# EAGLE design XBee-Explorer-Dongle-Sparkfun (EAGLE 6.6.0)
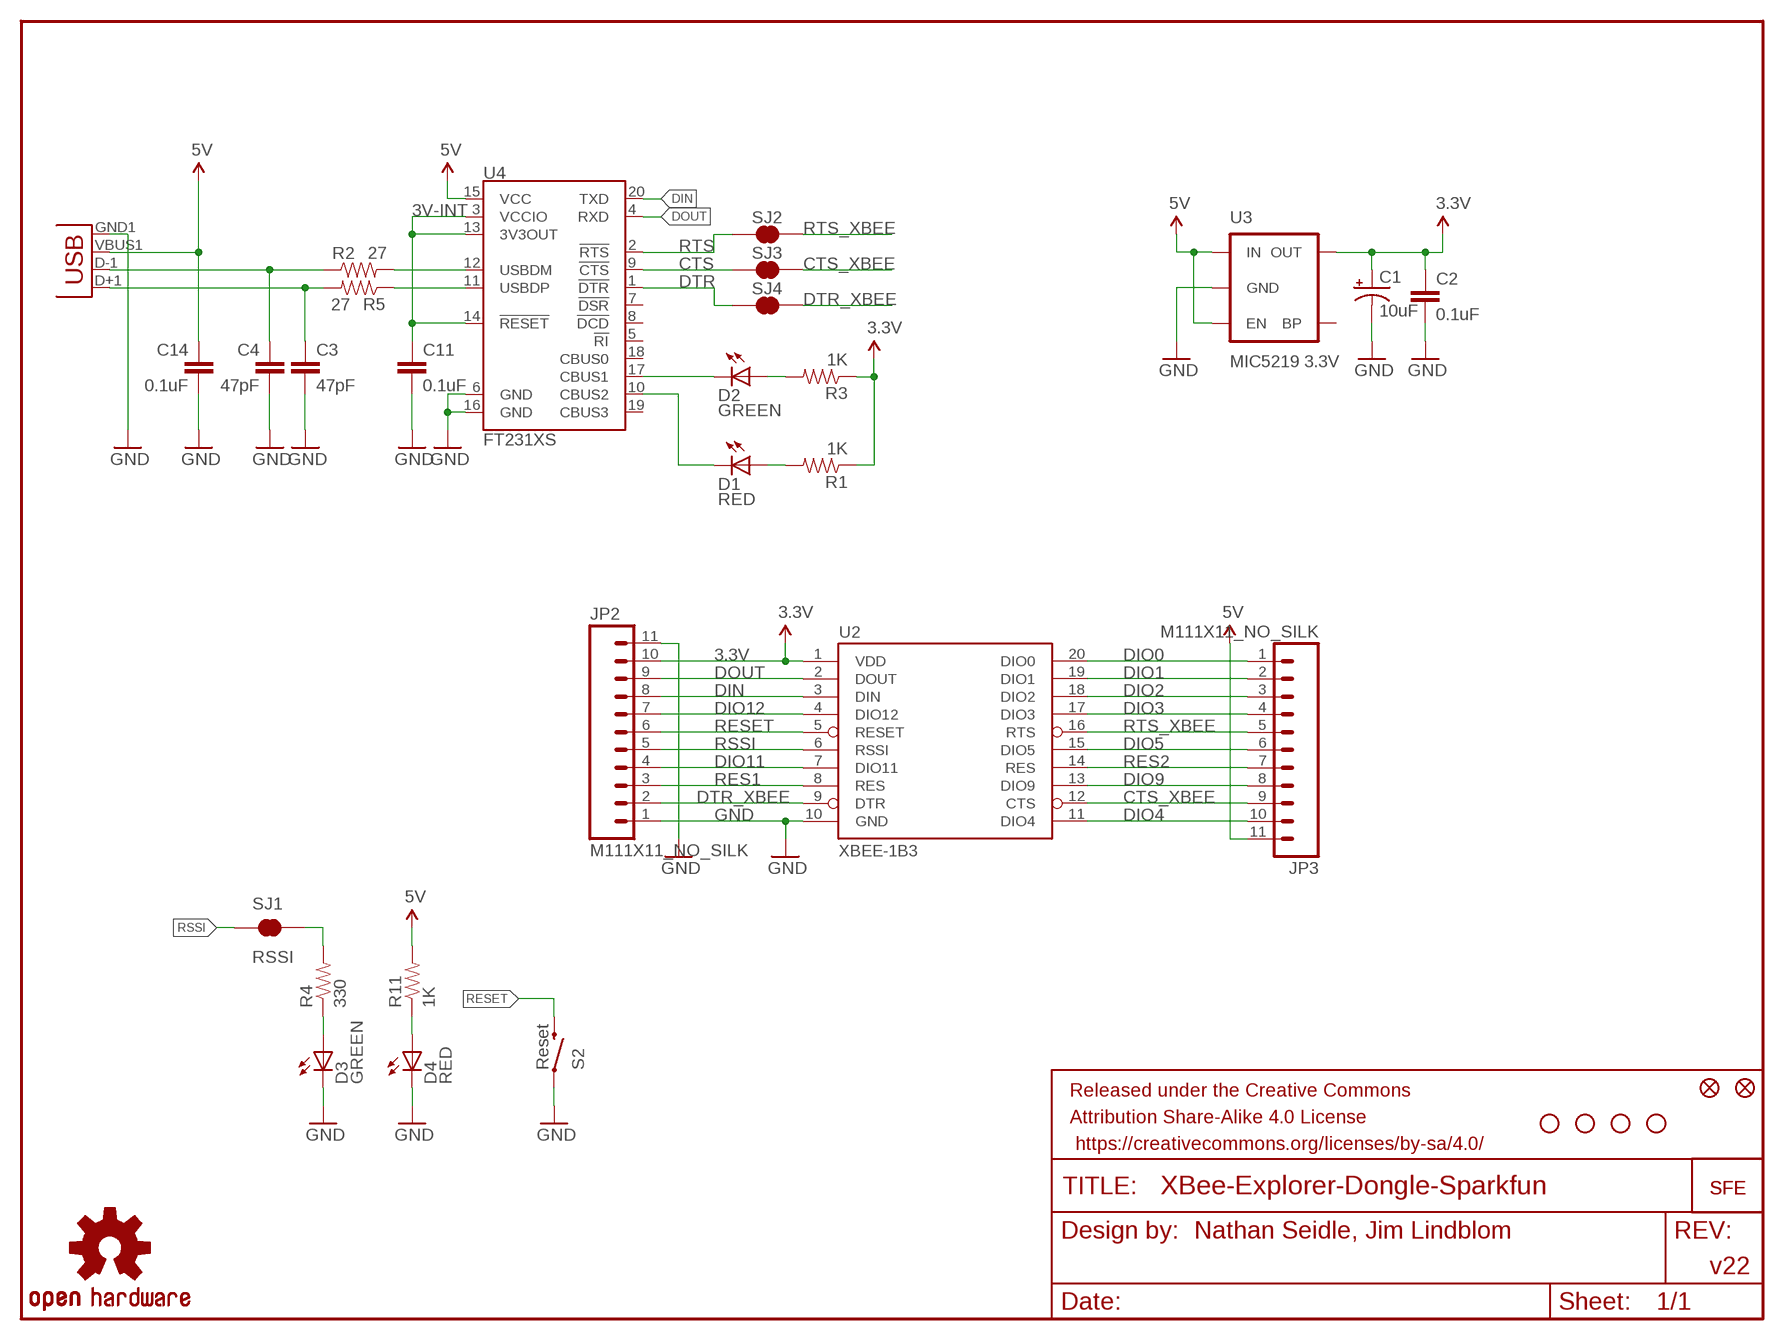
[diagram p0: schematic, sheet 1]

## Parts
C1  10uF  CAP_POL1206  [EIA3216]
C2  0.1uF  CAP0603-CAP  [0603-CAP]
C3  47pF  CAP0603-CAP  [0603-CAP]
C4  47pF  CAP0603-CAP  [0603-CAP]
C11  0.1uF  CAP0603-CAP  [0603-CAP]
C14  0.1uF  CAP0603-CAP  [0603-CAP]
D1  RED  LED-RED0603  [LED-0603]
D2  GREEN  LED-GREEN0603  [LED-0603]
D3  GREEN  LED-GREEN0603  [LED-0603]
D4  RED  LED-RED0603  [LED-0603]
FID1  FIDUCIAL1X2  [FIDUCIAL-1X2]
FID2  FIDUCIAL1X2  [FIDUCIAL-1X2]
FRAME1  FRAME-LETTER  [CREATIVE_COMMONS]
JP1  USBA-SMD-MALE-LOCKING  [USB-A-SMT-MALE-LOCKING]
JP2  M111X11_NO_SILK  [1X11_NO_SILK]
JP3  M111X11_NO_SILK  [1X11_NO_SILK]
R1  1K  RESISTOR0603-RES  [0603-RES]
R2  27  RESISTOR0603-RES  [0603-RES]
R3  1K  RESISTOR0603-RES  [0603-RES]
R4  330  RESISTOR0603-RES  [0603-RES]
R5  27  RESISTOR0603-RES  [0603-RES]
R11  1K  RESISTOR0603-RES  [0603-RES]
S2  Reset  SWITCH-MOMENTARY-2SMD  [TACTILE_SWITCH_SMD]
SJ1  RSSI  SOLDERJUMPERTRACE  [SJ_2S-TRACE]
SJ2  RSSI  SOLDERJUMPERTRACE  [SJ_2S-TRACE]
SJ3  RSSI  SOLDERJUMPERTRACE  [SJ_2S-TRACE]
SJ4  RSSI  SOLDERJUMPERTRACE  [SJ_2S-TRACE]
U2  XBEE-1B3  [XBEE-SMD]
U3  MIC5219 3.3V  V_REG_LDOSMD  [SOT23-5]
U4  FT231XS  [SSOP20_L]
U$1  LOGO-SFESK  [SFE-LOGO-FLAME]
U$4  LOGO-SFENEW  [SFE-NEW-WEBLOGO]
U$5  STAND-OFF  [STAND-OFF]
U$7  OSHW-LOGOS  [OSHW-LOGO-S]
U$9  STAND-OFF  [STAND-OFF]
U$10  STAND-OFF  [STAND-OFF]
U$11  STAND-OFF  [STAND-OFF]

## Nets
3.3V [vcc]: C1.A(+) C2.1 JP2.10 R1.1 R3.1 U2.1(VDD) U3.5(OUT)
3V-INT [vcc]: C11.1 U4.3(VCCIO) U4.13(3V3OUT) U4.14(!RESET)
5V [vcc]: C14.1 JP1.VBUS1(VBUS) JP3.11 R11.2 U3.1(IN) U3.3(EN) U4.15(VCC)
CTS: SJ3.1 U4.9(!CTS)
CTS_XBEE: JP3.9 SJ3.2 U2.12(CTS)
DIN: JP2.8 U2.3(DIN) U4.20(TXD)
DIO0: JP3.1 U2.20(DIO0)
DIO1: JP3.2 U2.19(DIO1)
DIO2: JP3.3 U2.18(DIO2)
DIO3: JP3.4 U2.17(DIO3)
DIO4: JP3.10 U2.11(DIO4)
DIO5: JP3.6 U2.15(DIO5)
DIO9: JP3.8 U2.13(DIO9)
DIO11: JP2.4 U2.7(DIO11)
DIO12: JP2.7 U2.4(DIO12)
DOUT: JP2.9 U2.2(DOUT) U4.4(RXD)
DTR: SJ4.1 U4.1(!DTR)
DTR_XBEE: JP2.2 SJ4.2 U2.9(DTR)
GND [vcc]: C1.C(-) C2.2 C3.2 C4.2 C11.2 C14.2 D3.C D4.C JP1.GND1(GND) JP2.1 JP2.11 S2.1 U2.10(GND) U3.2(GND) U4.6(GND) U4.16(GND)
N$1: D1.A R1.2
N$2: D3.A R4.1
N$3: C4.1 JP1.D-1(D-) R2.1
N$4: D2.A R3.2
N$5: R2.2 U4.12(USBDM)
N$6: C3.1 JP1.D+1(D+) R5.2
N$7: R5.1 U4.11(USBDP)
N$8: R4.2 SJ1.2
N$38: D4.A R11.1
RES1: JP2.3 U2.8(RES)
RES2: JP3.7 U2.14(RES)
RESET: JP2.6 S2.3 U2.5(RESET)
RSSI: JP2.5 SJ1.1 U2.6(RSSI)
RTS: SJ2.1 U4.2(!RTS)
RTS_XBEE: JP3.5 SJ2.2 U2.16(RTS)
RXLED: D2.C U4.17(CBUS1)
TXLED: D1.C U4.10(CBUS2)
Unconnected: U3.4(BP) U4.5(!RI) U4.7(!DSR) U4.8(!DCD) U4.18(CBUS0) U4.19(CBUS3)

## Notes on the sheet
- Nathan Seidle, Jim Lindblom
- v22

## Library data of the parts
C1 = SparkFun:CAP_POL: Capacitor Polarized These are standard SMD and PTH capacitors. Normally 10uF, 47uF, and 100uF in electrolytic and tantalum varieties. Always verify the external diameter of the through hole cap, it varies with capacity, voltage, and manufacturer. The EIA devices should be standard.
C2-C4 C11 C14 = SparkFun:CAP: Capacitor Standard 0603 ceramic capacitor, and 0.1" leaded capacitor.
D1 D4 = SparkFun-LED:LED-RED: Assorted Red LEDs LilyPad 1206- DIO-09912 1206- DIO-00809 0603- DIO-00819; PROD_ID: DIO-00819
D2 D3 = SparkFun-LED:LED-GREEN: Various green LEDs Green LEDs used in SFE Production 0603- DIO-00821 LARGE- DIO-00862 LILYPAD- DIO-09910; PROD_ID: DIO-00821
FID1 FID2 = SparkFun-Aesthetics:FIDUCIAL: Fiducial Alignment Points Various fiducial points for machine vision alignment.
FRAME1 = SparkFun-Aesthetics:FRAME-LETTER: Schematic Frame Standard 8.5x11 US Letter frame
JP1 = SparkFun-Connectors:USB: USB Connectors USB-B-PTH is fully proven SKU : PRT-00139/CONN-08278 USB-miniB is fully proven SKU : PRT-00587 USB-A-PCB is untested. USB-A-H is throughly reviewed, but untested. Spark Fun Electronics SKU : PRT-00437 USB-B-SMT is throughly reviewed, but untested. Needs silkscreen touching up. USB-A-S has not been used/tested USB-MB-H has not been used/tested USB-MICROB has been used. CONN-09505
JP2 JP3 = SparkFun:M11: Header 11 Standard 11-pin 0.1" header. Use with straight break away headers (SKU : PRT-00116), right angle break away headers (PRT-00553), swiss pins (PRT-00743), machine pins (PRT-00117), and female headers (PRT-00115).
R1-R5 R11 = SparkFun:RESISTOR: Resistor Basic schematic elements and footprints for 0603, 1206, and PTH resistors.
S2 = SparkFun-Electromechanical:SWITCH-MOMENTARY-2: Various NO switches- pushbuttons, reed, etc; PROD_ID: SWCH-08247
SJ1-SJ4 = SparkFun-Passives:SOLDERJUMPER: Solder Jumper Standard SMD solder jumper. Used to automate production. Two varients : Normally Open and Normally Closed are the same, but have different paste layers. NC will have a large amount of paste and should jumper during reflow.
U2 = SparkFun-RF:XBEE-1: Xbee module footprints SMT header is CONN-09042.; PROD_ID: CONN-09042
U3 = SparkFun:V_REG_LDO: Voltage Regulator LDO Standard 150mA LDO voltage regulator in SOT-23 layout. Micrel part MIC5205. BP (by-pass) pin is used to lower output noise with 470pF cap.
U4 = SparkFun-DigitalIC:FT231X: FTDI FT231X Full Speed USB to Full-handshake UART This USB2.0 Full Speed IC offers a compact bridge to full handshake UART interfaces. The device is a UART, capable of operating up to 3MBaud, with low power consumption (8mA). The FT231X includes the complete FT-X series feature set and enables USB to be added into a system design quickly and easily over a UART interface.
U$1 U$4 = SparkFun:LOGO-SFE: Spark Fun Electronics PCB Logo This is the standard Spark Fun Electronics PCB logo.
U$5 U$9-U$11 = SparkFun:STAND-OFF: Stand Off This is the mechanical footprint for a #4 phillips button head screw. Use the keepout ring to avoid running the screw head into surrounding components. SKU : PRT-00447
U$7 = SparkFun:OSHW-LOGO: Open Source Hardware Logo This logo indicates the piece of hardware it is found on incorporates a OSHW license and/or adheres to the definition of open source hardware found here: http://freedomdefined.org/OSHW

## Net classes
0 default: width 0.203 mm
1 vcc: width 0.254 mm
2 gnd: width 0.254 mm

## Board
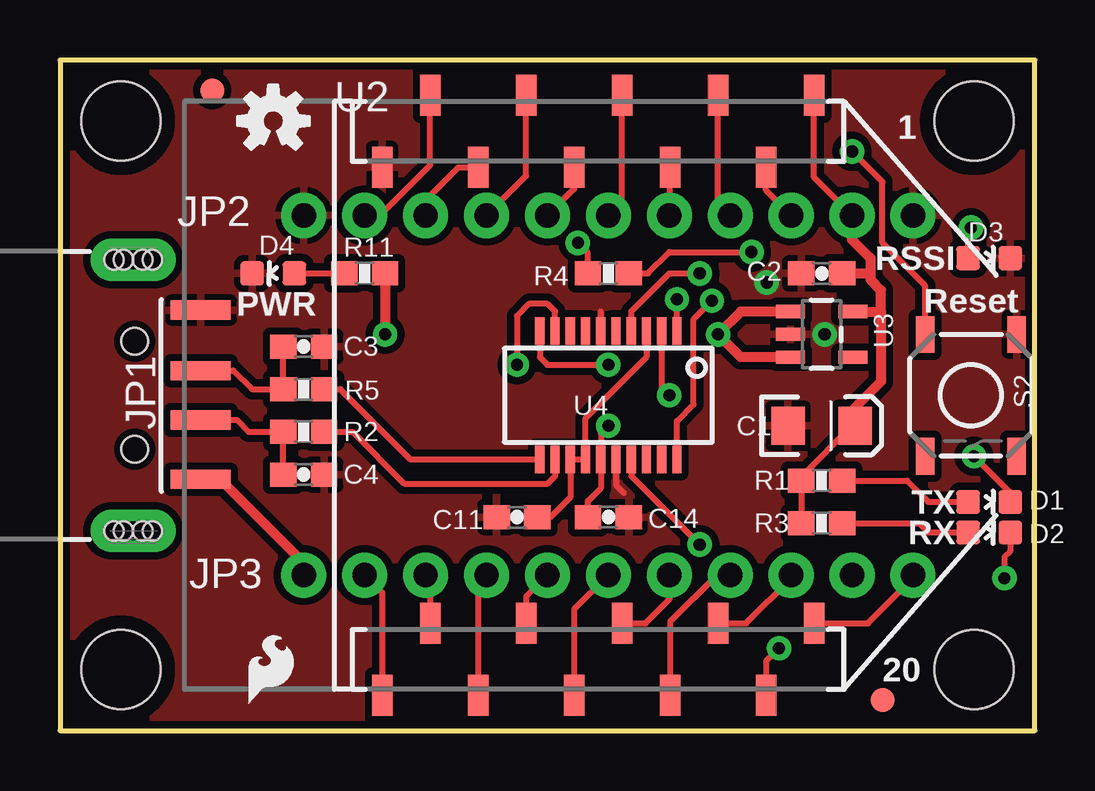
[diagram p1: board, top side]
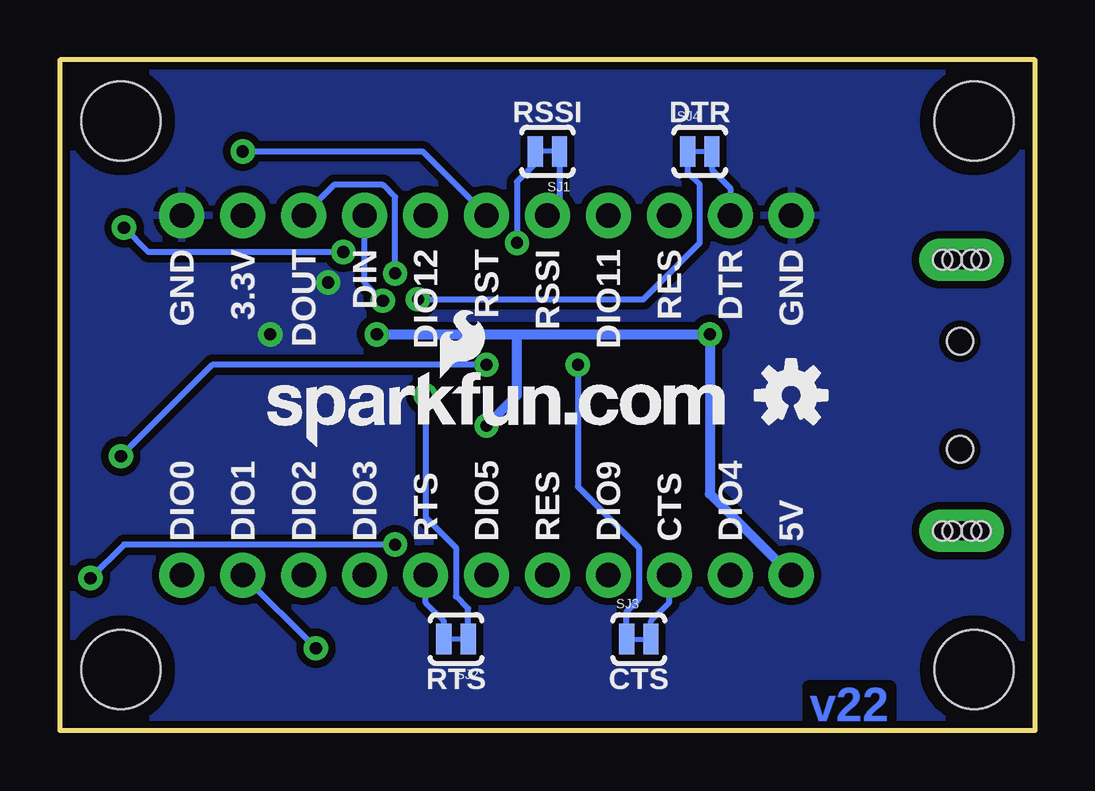
[diagram p2: board, bottom side, seen from below]

Size 40.64 x 27.94 mm. Coordinates in mm from the lower left corner, seen from the top.
Outline: 40.64,0 40.64,27.94 0,27.94 0,0 40.64,0
Copper layers (1*16): Top 0.035mm / dielectric 1.5mm / Bottom 0.035mm
Design rules "SparkFun-2-layer": minimum track width 7mil, minimum drill 15mil, track to track 8mil, track to pad 8mil, pad to pad 8mil, via to via 8mil, smd to smd 8mil, copper to edge 8mil, drill to drill 8mil, minimum pad ring 12mil, minimum via ring 10mil, stop-mask expansion 4mil, vias tented up to drill 20mil, thermal gap 10mil

### Footprints (pad centres in the part's own frame; a part is rotated, then mirrored left to right if it is on the bottom)
EIA3216 = smd 1.4 x 1.6: A 1.4,0; C -1.4,0
0603-CAP = smd 1.1 x 1: 1 -0.85,0; 2 0.85,0
LED-0603 = smd 1 x 1: A 0,-0.877; C 0,0.877
FIDUCIAL-1X2 = smd 1 x 1: 1 0,0
USB-A-SMT-MALE-LOCKING = smd 0.8 x 2.5: D+1 1.027,-5.87; D-1 -1.027,-5.87; GND1 3.551,-5.87; VBUS1 -3.5,-5.87 | drill 0.8 pad 1.778 long: P$1 5.647,-3.05; P$3 -5.647,-3.05 | hole 1.1: 2.25,-3.12; -2.25,-3.12 | hole 0.8: -5.647,-3.45; -5.647,-3.85; -5.647,-2.65; -5.647,-2.25; 5.647,-3.45; 5.647,-3.85; 5.647,-2.65; 5.647,-2.25
1X11_NO_SILK = drill 1.016 pad 1.88: 1 0,0; 2 2.54,0; 3 5.08,0; 4 7.62,0; 5 10.16,0; 6 12.7,0; 7 15.24,0; 8 17.78,0; 9 20.32,0; 10 22.86,0; 11 25.4,0
0603-RES = smd 1.1 x 1: 1 -0.85,0; 2 0.85,0
TACTILE_SWITCH_SMD = smd 1.524 x 0.762: 1 -2.54,1.905; 2 2.54,1.905; 3 -2.54,-1.905; 4 2.54,-1.905
SJ_2S-TRACE = smd 0.635 x 1.27: 1 -0.508,0; 2 0.508,0
XBEE-SMD = smd 1.7 x 0.85: 1 -12.5,20; 2 -9.5,18; 3 -12.5,16; 4 -9.5,14; 5 -12.5,12; 6 -9.5,10; 7 -12.5,8; 8 -9.5,6; 9 -12.5,4; 10 -9.5,2; 11 12.5,2; 12 9.5,4; 13 12.5,6; 14 9.5,8; 15 12.5,10; 16 9.5,12; 17 12.5,14; 18 9.5,16; 19 12.5,18; 20 9.5,20
SOT23-5 = smd 0.55 x 1.2: 1 -0.95,-1.3; 2 0,-1.3; 3 0.95,-1.3; 4 0.95,1.3; 5 -0.95,1.3
SSOP20_L = smd 0.381 x 1.143: 1 -2.857,-2.68; 2 -2.223,-2.68; 3 -1.587,-2.68; 4 -0.953,-2.68; 5 -0.318,-2.68; 6 0.318,-2.68; 7 0.953,-2.68; 8 1.587,-2.68; 9 2.223,-2.68; 10 2.857,-2.68; 11 2.857,2.68; 12 2.223,2.68; 13 1.587,2.68; 14 0.953,2.68; 15 0.318,2.68; 16 -0.318,2.68; 17 -0.953,2.68; 18 -1.587,2.68; 19 -2.223,2.68; 20 -2.857,2.68
STAND-OFF = hole 3.302: 0,0

### Placement (x,y rotation side)
C1  31.75,12.7 0 top
C2  31.75,19.05 180 top
C3  10.16,16 0 top
C4  10.16,10.67 0 top
C11  19.05,8.89 180 top
C14  22.86,8.89 0 top
D1  38.73,9.53 270 top
D2  38.73,8.26 270 top
D3  38.73,19.69 270 top
D4  8.89,19.05 90 top
FID1  6.35,26.67 0 top
FID2  34.29,1.27 0 top
FRAME1  6.35,-8.89 0 top  (outside the outline)
JP1  0,13.97 90 top
JP2  10.16,21.46 0 top
JP3  35.56,6.48 180 top
R1  31.75,10.41 0 top
R2  10.16,12.45 0 top
R3  31.75,8.64 0 top
R4  22.86,19.05 180 top
R5  10.16,14.22 180 top
R11  12.7,19.05 0 top
S2  37.97,13.97 270 top
SJ1  20.32,24.13 180 bottom
SJ2  24.13,3.81 180 bottom
SJ3  16.51,3.81 0 bottom
SJ4  13.97,24.13 0 bottom
U2  11.43,13.97 270 top
U3  31.75,16.51 270 top
U4  22.86,13.97 180 top
U$1  7.87,1.14 0 top
U$4  32,11.81 0 bottom
U$5  2.54,2.54 0 top
U$7  8.89,25.4 0 top
U$8  OSHW-LOGOS  [OSHW-LOGO-S]  10.16,13.97 0 bottom
U$9  2.54,25.4 0 top
U$10  38.1,25.4 0 top
U$11  38.1,2.54 0 top

### Tracks (layer width: path | path; a pad name or v marks a point on that pad's centre or on a via)
3.3V
  Top 0.254: JP2.10 31.43,23.05 U2.1 | R3.1 R1.1 30.9,10.58 33.02,12.7 C1.A
  Top 0.406: C1.A 33.15,13.46 34.23,14.54 34.23,17.46 | U3.5 34.23,17.46 | JP2.10 33.02,20.45 33.78,19.69 33.78,19.05 | 33.78,19.05 33.78,18.8 34.23,18.35 34.23,17.46 | C2.1 33.78,19.05
3V-INT
  Top 0.254: C11.1 20.45,8.89 21.27,9.71 U4.13 U4.14 21.91,13.02 24.45,15.56 U4.3
5V  (via drill 0.51)
  Top 0.254: C14.1 22.01,9.56 22.54,10.1 U4.15 22.54,12.38 v22.86,12.7
  Top 0.406: JP1.VBUS1 6.68,10.47 10.16,6.99 JP3.11 | R11.2 v13.55,16.51 | U3.1 28.38,17.46 v27.43,16.51 28.38,15.56 U3.3
  Bottom 0.406: JP3.11 13.55,9.87 v13.55,16.51 21.59,16.51 | v27.43,16.51 21.59,16.51 | v22.86,12.7 21.59,13.97 21.59,16.51
CTS  (via drill 0.51)
  Top 0.254: U4.9 20.64,17.46 20.32,17.78 19.56,17.78 19.05,17.27 v19.05,15.24
  Bottom 0.254: v19.05,15.24 19.05,10.16 16.51,7.62 16.51,5.46 17.02,4.95 SJ3.1
CTS_XBEE
  Top 0.254: JP3.9 15.43,6.29 U2.12
  Bottom 0.254: SJ3.2 16,4.57 15.24,5.33 JP3.9
DIN  (via drill 0.51)
  Top 0.254: JP2.8 27.43,21.97 U2.3 | U4.20 25.72,12.89 26.42,13.59 26.42,17.14 v27.18,17.91
  Bottom 0.254: v27.18,17.91 27.94,18.67 JP2.8
DIO0
  Top 0.254: U2.20 33.68,4.47 35.56,6.35 JP3.1
DIO1  (via drill 0.51)
  Top 0.254: v29.97,3.43 29.43,2.89 U2.19
  Bottom 0.254: JP3.2 v29.97,3.43
DIO2
  Top 0.254: U2.18 28.6,4.47 30.48,6.35 JP3.3
DIO3
  Top 0.254: JP3.4 27.38,6.48 25.43,4.53 U2.17
DIO4
  Top 0.254: JP3.10 13.43,5.75 U2.11
DIO5
  Top 0.254: JP3.6 21.43,5.05 U2.15
DIO9
  Top 0.254: JP3.8 17.43,6.13 U2.13
DIO11
  Top 0.254: JP2.4 19.43,23.11 U2.7
DIO12
  Top 0.254: JP2.7 25.43,21.49 U2.4
DOUT  (via drill 0.51)
  Top 0.254: JP2.9 29.43,22.51 U2.2 | U4.4 23.81,17.46 25.4,19.05 v26.67,19.05
  Bottom 0.254: v26.67,19.05 26.67,22.23 27.18,22.73 29.21,22.73 JP2.9
DTR  (via drill 0.51)
  Top 0.254: U4.1 v25.72,17.97
  Bottom 0.254: v25.72,17.97 16.32,17.97 13.97,20.32 13.97,22.73 14.48,23.24 SJ4.1
DTR_XBEE
  Top 0.254: JP2.2 13.34,21.46 15.43,23.56 U2.9
  Bottom 0.254: SJ4.2 13.46,23.37 12.7,22.61 JP2.2
GND  (via drill 0.51)
  Top 0.254: U4.16 23.18,10.22 23.5,9.91 | U4.6 22.54,17.46
  other vias: 31.88,16.51 29.46,18.67
  pour Bottom (isolate 0.305): 0,27.94 40.64,27.94 40.64,0 0,0
  pour Top (isolate 0.305): 0,27.94 40.64,27.94 40.64,0 0,0
N$1
  Top 0.254: R1.2 35.31,10.41 36.2,9.53 D1.A
N$2  (via drill 0.51)
  Top 0.254: R4.1 24.51,19.05 25.4,19.94 v28.83,19.94 | D3.A 37.86,20.84 v37.97,20.96
  Bottom 0.254: v28.83,19.94 36.96,19.94 v37.97,20.96
N$3
  Top 0.254: JP1.D-1 7.38,12.94 7.87,12.45 R2.1 C4.1
N$4
  Top 0.254: R3.2 35.81,8.64 36.2,8.26 D2.A
N$5
  Top 0.254: R2.2 12.19,12.45 14.35,10.29 20.32,10.29 20.64,10.61 U4.12
N$6
  Top 0.254: C3.1 R5.2 8,14.22 7.23,15 JP1.D+1
N$7
  Top 0.254: R5.1 11.68,14.22 14.62,11.29 U4.11
N$8  (via drill 0.51)
  Top 0.254: v21.59,20.32 22.01,19.9 R4.2
  Bottom 0.254: SJ1.2 20.83,23.62 21.59,22.86 v21.59,20.32
N$38
  Top 0.254: D4.A R11.1
RES1
  Top 0.254: JP2.3 15.24,22.1 16.61,23.47 U2.8 | U2.8
RES2
  Top 0.254: JP3.7 19.43,5.59 U2.14
RESET  (via drill 0.51)
  Top 0.254: JP2.6 23.43,22.03 U2.5 | S2.3 36.07,18.54 34.29,20.32 34.29,22.86 v33.02,24.13
  Bottom 0.254: v33.02,24.13 25.53,24.13 JP2.6
RSSI
  Top 0.254: U2.6 21.43,22.57 JP2.5
  Bottom 0.254: SJ1.1 19.81,21.97 JP2.5
RTS  (via drill 0.51)
  Top 0.254: U4.2 25.08,14.29 v25.4,13.97
  Bottom 0.254: v25.4,13.97 25.4,8.89 24.13,7.62 24.13,5.59 23.62,5.08 SJ2.1
RTS_XBEE
  Top 0.254: U2.16 24.41,4.47 25.4,5.46 JP3.5
  Bottom 0.254: SJ2.2 24.64,4.57 25.4,5.33 JP3.5
RXLED  (via drill 0.51)
  Top 0.254: U4.17 23.81,10.61 v26.67,7.75 | D2.C 39.61,7.48 39.37,7.24 v39.37,6.35
  Bottom 0.254: v26.67,7.75 37.97,7.75 v39.37,6.35
TXLED  (via drill 0.51)
  Top 0.254: U4.10 20,15.56 20.32,15.24 v22.86,15.24 | D1.C 39.61,9.92 v38.1,11.43
  Bottom 0.254: v22.86,15.24 34.29,15.24 v38.1,11.43

### Text on the board
Bottom: v22
tPlace: 1 | RSSI | PWR | Reset | TX | RX | 20
bPlace: DTR | RSSI | GND | DTR | RES | DIO11 | RSSI | RST | DIO12 | DIN | DOUT | 3.3V | GND | 5V | DIO4 | CTS | DIO9 | RES | DIO5 | RTS | DIO3 | DIO2 | DIO1 | DIO0 | CTS | RTS
tValues: XBee Socket Up | DNP | DNP | XBee Socket Up
tDocu: Nathan Seidle, Jim Lindblom